# EAGLE design LIS3MDL (EAGLE 7.1.0)
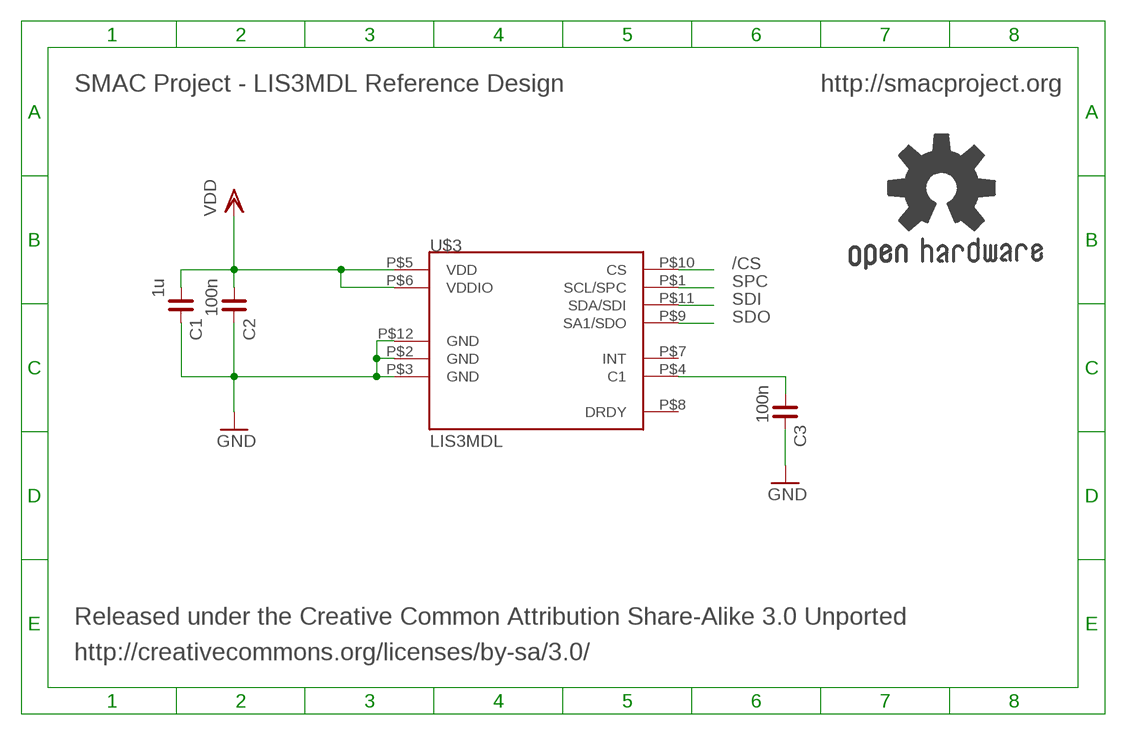
[diagram p0: schematic, sheet 1]

## Parts
C1  1u  C_0402  [C0402]
C2  100n  C_0402  [C0402]
C3  100n  C_0402  [C0402]
GOLD_ORB_SM1  OSHWLOGO_REF_SM  [OSHW2REF]
U$3  LIS3MDL  [VFLGA-2X2X1]

## Nets
/CS: U$3.P$10(CS)
GND: C1.2 C2.2 C3.2 U$3.P$2(GND) U$3.P$3(GND) U$3.P$12(GND)
N$3: C3.1 U$3.P$4(C1)
SDI: U$3.P$11(SDA/SDI)
SDO: U$3.P$9(SA1/SDO)
SPC: U$3.P$1(SCL/SPC)
VDD: C1.1 C2.1 U$3.P$5(VDD) U$3.P$6(VDDIO)
Unconnected: U$3.P$7(INT) U$3.P$8(DRDY)

## Notes on the sheet
- SMAC Project - LIS3MDL Reference Design | http://smacproject.org
- Released under the Creative Common Attribution Share-Alike 3.0 Unported
- http://creativecommons.org/licenses/by-sa/3.0/

## Library data of the parts
C1-C3 = rc-master-smd:C_: NON-POLARIZED CAP
GOLD_ORB_SM1 = bfl:OSHWLOGO: These are Open-Source Hardware logos.
U$3 = SparkFun-Sensors:LIS3MDL

## Board
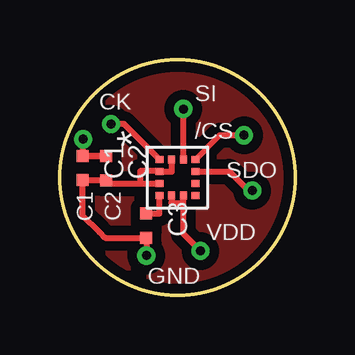
[diagram p1: board, top side]
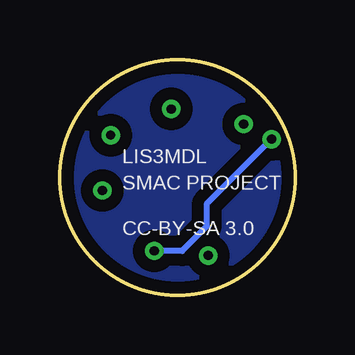
[diagram p2: board, bottom side, seen from below]

Size 9.8 x 9.8 mm. Coordinates in mm from the lower left corner, seen from the top.
Outline: circle at 4.9,4.9 radius 4.9
Copper layers (1*16): Top 0.035mm / dielectric 1.5mm / Bottom 0.035mm
Design rules "2_layer_standard_4pcb": minimum track width 5mil, minimum drill 15mil, track to track 6mil, track to pad 6mil, pad to pad 6mil, via to via 6mil, smd to smd 0mil, copper to edge 6mil, drill to drill 6mil, minimum pad ring 7.5mil, minimum via ring 7.5mil, stop-mask expansion 4mil, vias tented up to drill 15mil, thermal gap 20mil

### Footprints (pad centres in the part's own frame; a part is rotated, then mirrored left to right if it is on the bottom)
C0402 = smd 0.5 x 0.5: 1 -0.508,0; 2 0.508,0
VFLGA-2X2X1 = smd 0.325 x 0.3: P$1 -0.75,0.75; P$2 -0.75,0.25; P$3 -0.75,-0.25; P$4 -0.75,-0.75; P$7 0.75,-0.75; P$8 0.75,-0.25; P$9 0.75,0.25; P$10 0.75,0.75 | smd 0.3 x 0.325: P$5 -0.25,-0.75; P$6 0.25,-0.75; P$11 0.25,0.75; P$12 -0.25,0.75

### Placement (x,y rotation side)
C1  0.95,5.29 270 top
C2  1.93,5.28 270 top
C3  3.6,2.88 270 top
GOLD_ORB_SM1  11.56,1.44 0 top
U$3  4.9,4.9 0 top

### Tracks (layer width: path | path; a pad name or v marks a point on that pad's centre or on a via)
/CS  (via drill 0.38 pad 0.76)
  Top 0.25: U$3.P$10 6.66,6.66 v7.68,6.66
GND  (via drill 0.38 pad 0.76)
  Top 0.25: 3.35,4.65 2.06,4.65 C2.2 1.94,4.78 C1.2 0.95,3.32 1.65,2.61 1.89,2.38 C3.2 3.61,2.37 v3.61,1.64 | 3.35,4.65 U$3.P$3 | 3.35,4.65 3.35,5.16 4.14,5.16 U$3.P$2 arc90 4.17,5.13 4.66,5.13 U$3.P$12
N$3
  Top 0.25: C3.1 4.15,3.39 U$3.P$4
N$8
  pour Bottom (isolate 0.5): 0.1,4.9 arc90 4.9,0.1 arc90 9.7,4.9 arc90 4.9,9.7 arc90
  pour Top (isolate 0.4): 0.1,4.89 arc90 4.9,0.09 arc90 9.7,4.9 arc90 4.9,9.7 4.9,9.69 arc90
SDI  (via drill 0.38 pad 0.76)
  Top 0.25: U$3.P$11 v5.15,7.75
SDO  (via drill 0.38 pad 0.76)
  Top 0.25: U$3.P$9 7.07,5.15 7.87,4.35 v8.03,4.35
SPC  (via drill 0.38 pad 0.76)
  Top 0.25: U$3.P$1 2.68,7.12 v2.13,7.12
VDD  (via drill 0.38 pad 0.76)
  Top 0.25: C1.1 C2.1 0.89,5.79 arc-90 0.86,5.82 | U$3.P$5 4.65,3.83 5.15,3.83 U$3.P$6 5.15,2.55 v5.87,1.83 | 0.86,5.82 0.97,5.82 | 0.86,5.82 0.97,5.93 v0.97,6.49
  Bottom 0.25: v0.97,6.49 3.68,3.78 3.68,2.86 4.7,1.83 v5.87,1.83

### Text on the board
tPlace: CK | SI | /CS | SDO | C1 | C2 | VDD | GND
bPlace: LIS3MDL | SMAC PROJECT | CC-BY-SA 3.0
Reference: http://smacproject.org